# Altium schematic sheet Ada - Base Block - PSU and Connectors Issue 4.0.SchDoc: Title
size A3; DrawnBy: Name; DocumentNumber: 4; Revision: A; SheetNumber: 4; SheetTotal: 4
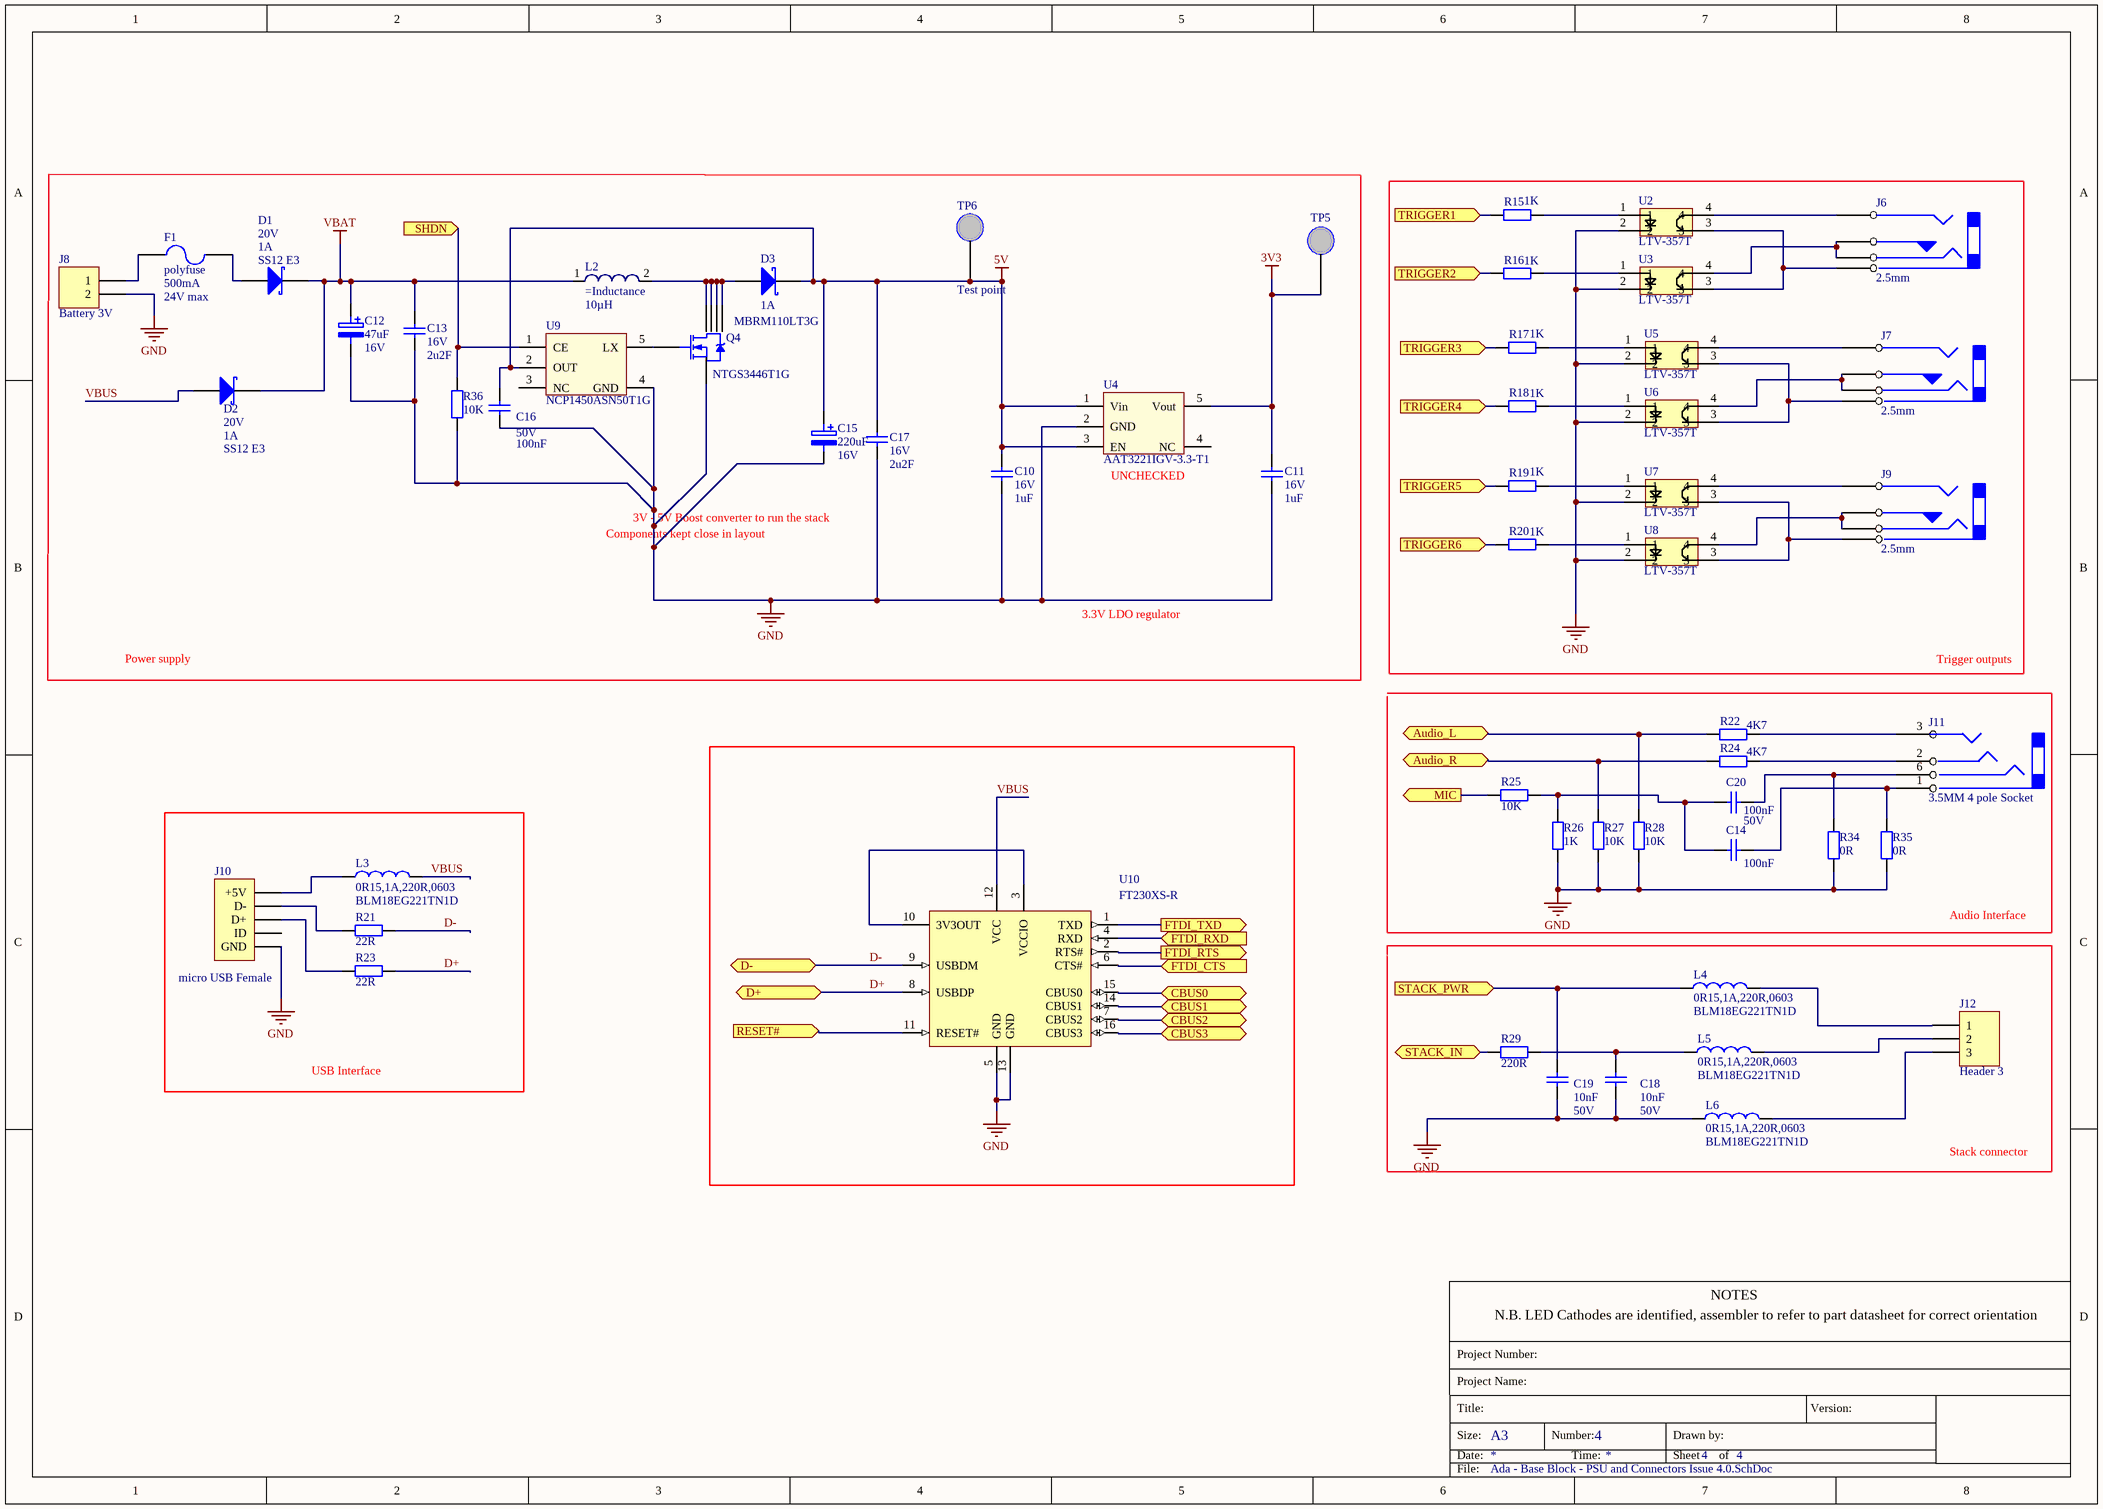
[diagram p0: Ada - Base Block - PSU and Connectors Issue 4.0.SchDoc]

## Parts
C10  value 1uF  Voltage: 16V  [C0603]  (hidden comment: 1uF, 16V, 0603)
C11  value 1uF  Voltage: 16V  [C0603]  (hidden comment: 1uF, 16V, 0603)
C12  value 47uF  Voltage: 16V  [CAP6.8/6.8]  (hidden comment: 10uF,16V,SMD)
C13  Voltage: 16V  [C0603]  (hidden comment: 2u2F)
C14  value 100nF  [C0603]  (hidden comment: 100nF, 16V, 0603)
C15  value 220uF  Voltage: 16V  [CAP6.8/6.8]  (hidden comment: 220uF, 16V, SMD)
C16  value 100nF  Voltage: 50V  [C0603]  (hidden comment: 100nF, 16V, 0603)
C17  Voltage: 16V  [C0603]  (hidden comment: 2u2F)
C18  value 10nF  Voltage: 50V  [C0603]  (hidden comment: Capacitor 0603)
C19  value 10nF  Voltage: 50V  [C0603]  (hidden comment: Capacitor 0603)
C20  value 100nF  Voltage: 50V  [C0603]  (hidden comment: 100nF, 16V, 0603)
D1  value SS12 E3  Voltage: 20V  Current: 1A  [DO214-AA]  (hidden comment: BYM13-40)
D2  value SS12 E3  Voltage: 20V  Current: 1A  [DO214-AA]  (hidden comment: BYM13-40)
D3  Current: 1A  [POWERMITE]  (hidden comment: MBRM110LT3G)
F1  value polyfuse  Current: 500mA  Voltage: 24V max  [1210 FUSE]  (hidden comment: 500mA polyfuse)
J6  value 2.5mm  [2.5mm socket TRI001]  (hidden comment: 2.5mm PHONEJACK STEREO TRI001)
J7  value 2.5mm  [2.5mm socket TRI001]  (hidden comment: 2.5mm PHONEJACK STEREO TRI001)
J8  Battery 3V  [Molex 0022057025]
J9  value 2.5mm  [2.5mm socket TRI001]  (hidden comment: 2.5mm PHONEJACK STEREO TRI001)
J10  micro USB Female  [micro usb receptacle]
J11  value 3.5MM 4 pole Socket  [Cliff 3.5mm 4 pole socket]  (hidden comment: 3.5mm PHONEJACK STEREO TRI001)
J12  Header 3  [sip3]
L2  value 10µH  [WE-PD2_5848]
L3  0R15,1A,220R,0603  value BLM18EG221TN1D  [L0603]
L4  0R15,1A,220R,0603  value BLM18EG221TN1D  [L0603]
L5  0R15,1A,220R,0603  value BLM18EG221TN1D  [L0603]
L6  0R15,1A,220R,0603  value BLM18EG221TN1D  [L0603]
Q4  value NTGS3446T1G  [TSOP6]
R15  value 1K  [R0603]  (hidden comment: Resistor 0603)
R16  value 1K  [R0603]  (hidden comment: Resistor 0603)
R17  value 1K  [R0603]  (hidden comment: Resistor 0603)
R18  value 1K  [R0603]  (hidden comment: Resistor 0603)
R19  value 1K  [R0603]  (hidden comment: Resistor 0603)
R20  value 1K  [R0603]  (hidden comment: Resistor 0603)
R21  value 22R  [R0603]  (hidden comment: Resistor 0603)
R22  value 4K7  [R0603]  (hidden comment: Resistor 0603)
R23  value 22R  [R0603]  (hidden comment: Resistor 0603)
R24  value 4K7  [R0603]  (hidden comment: Resistor 0603)
R25  value 10K  [R0603]  (hidden comment: Resistor 0603)
R26  value 1K  [R0603]  (hidden comment: Resistor 0603)
R27  value 10K  [R0603]  (hidden comment: Resistor 0603)
R28  value 10K  [R0603]  (hidden comment: Resistor 0603)
R29  value 220R  [R0603]  (hidden comment: Resistor 0603)
R34  0R  [R0603]
R35  0R  [R0603]
R36  value 10K  [R0603]  (hidden comment: Resistor 0603)
TP5  Test point  [TP]  (value not drawn)  (no BOM)
TP6  Test point  [TP]  (no BOM)
U2  value LTV-357T  [SMD-4]  (hidden comment: LTV-817)
U3  value LTV-357T  [SMD-4]  (hidden comment: LTV-817)
U4  AAT3221IGV-3.3-T1  [TSOT 5 pin]
U5  value LTV-357T  [SMD-4]  (hidden comment: LTV-817)
U6  value LTV-357T  [SMD-4]  (hidden comment: LTV-817)
U7  value LTV-357T  [SMD-4]  (hidden comment: LTV-817)
U8  value LTV-357T  [SMD-4]  (hidden comment: LTV-817)
U9  value NCP1450ASN50T1G  [SOT23-5AN]  (hidden comment: NCP1450)
U10  FT230XS-R  [SSOP-16_N]

## Blocks framed on the sheet
Trigger outputs: J6 J7 J9 R15-R20 U2 U3 U5-U8
Audio Interface: C14 C20 J11 R22 R24-R28 R34 R35
USB Interface: J10 L3 R21 R23
Stack connector: C18 C19 J12 L4-L6 R29

## Ports
Audio_L (bidir), Audio_R (bidir), CBUS0 (bidir), CBUS1 (bidir), CBUS2 (bidir), CBUS3 (bidir), D+ (bidir), D- (bidir), FTDI_CTS (in), FTDI_RTS (out), FTDI_RXD (in), FTDI_TXD (out), MIC (out), RESET# (in), SHDN (in), STACK_IN (bidir), STACK_PWR (in), TRIGGER1 (in), TRIGGER2 (in), TRIGGER3 (in), TRIGGER4 (in), TRIGGER5 (in), TRIGGER6 (in)

## Nets
3V3: C11.2 TP5.1 U4.5(Vout)
5V: C10.2 C15.1 C16.2 C17.2 D3.K TP6.1 U4.1(Vin) U4.3(EN) U9.2(OUT)
GND: C10.1 C11.1 C12.2 C13.1 C15.2 C16.1 C17.1 C18.1 C19.1 J8.2 J10.5(GND) L6.2 Q4.4(S) R26.2 R27.2 R28.2 R34.2 R35.2 R36.2 U2.2 U3.2 U4.2(GND) U5.2 U6.2 U7.2 U8.2 U9.4(GND) U10.5(GND) U10.13(GND)
VBAT: C12.1 C13.2 D1.K D2.K L2.1
Audio_L: R22.2 R28.1 ; port Audio_L
Audio_R: R24.2 R27.1 ; port Audio_R
CBUS0: U10.15(CBUS0) ; port CBUS0
CBUS1: U10.14(CBUS1) ; port CBUS1
CBUS2: U10.7(CBUS2) ; port CBUS2
CBUS3: U10.16(CBUS3) ; port CBUS3
D+: R23.1 U10.8(USBDP) ; port D+
D-: R21.1 U10.9(USBDM) ; port D-
FTDI_CTS: U10.6(CTS#) ; port FTDI_CTS
FTDI_RTS: U10.2(RTS#) ; port FTDI_RTS
FTDI_RXD: U10.4(RXD) ; port FTDI_RXD
FTDI_TXD: U10.1(TXD) ; port FTDI_TXD
MIC: R25.1 ; port MIC
RESET#: U10.11(RESET#) ; port RESET#
SHDN: R36.1 U9.1(CE) ; port SHDN
STACK_IN: R29.1 ; port STACK_IN
STACK_PWR: C19.2 L4.2 ; port STACK_PWR
TRIGGER1: R15.2 ; port TRIGGER1
TRIGGER2: R16.2 ; port TRIGGER2
TRIGGER3: R17.2 ; port TRIGGER3
TRIGGER4: R18.2 ; port TRIGGER4
TRIGGER5: R19.2 ; port TRIGGER5
TRIGGER6: R20.2 ; port TRIGGER6
VBUS: D2.A L3.2 U10.12(VCC)
NetC14_1: C14.1 J11.1 R35.1
NetC14_2: C14.2 C20.2 R25.2 R26.1
NetC18_2: C18.2 L5.2 R29.2
NetC20_1: C20.1 J11.6 R34.1
NetD1_A: D1.A F1.2
NetD3_A: D3.A L2.2 Q4.1(D) Q4.2(D) Q4.5(D) Q4.6(D)
NetF1_1: F1.1 J8.1
NetJ6_1: J6.1 U2.3 U3.3
NetJ6_2: J6.2 J6.3 U3.4
NetJ6_4: J6.4 U2.4
NetJ7_1: J7.1 U5.3 U6.3
NetJ7_2: J7.2 J7.3 U6.4
NetJ7_4: J7.4 U5.4
NetJ9_1: J9.1 U7.3 U8.3
NetJ9_2: J9.2 J9.3 U8.4
NetJ9_4: J9.4 U7.4
NetJ10_1: J10.1(+5V) L3.1
NetJ10_2: J10.2(D-) R21.2
NetJ10_3: J10.3(D+) R23.2
NetJ11_2: J11.2 R24.1
NetJ11_3: J11.3 R22.1
NetJ12_1: J12.1 L4.1
NetJ12_2: J12.2 L5.1
NetJ12_3: J12.3 L6.1
NetQ4_3: Q4.3(G) U9.5(LX)
NetR15_1: R15.1 U2.1
NetR16_1: R16.1 U3.1
NetR17_1: R17.1 U5.1
NetR18_1: R18.1 U6.1
NetR19_1: R19.1 U7.1
NetR20_1: R20.1 U8.1
NetU10_3: U10.3(VCCIO) U10.10(3V3OUT)

Not connected (* = marked no-connect by the designer): J10 4(ID); U4 4(NC); U9 3(NC)

## Notes on the sheet
- (near U4) UNCHECKED
- Components kept close in layout
- 3V - 5V Boost converter to run the stack
- 3.3V LDO regulator
- Power supply
- N.B. LED Cathodes are identified, assembler to refer to part datasheet for correct orientation
- NOTES
- Project Name:
- Project Number:
- Title:
- Size:
- Date:
- A3
- Number:
- Time:
- Sheet
- Drawn by:
- of
- Version:
- File:

## Library data of the parts
C10 C11 = 1uF, 16V, 0603: Ceramic; Manufacturer: KEMET; Manuf Part #: C0603C105K4PAC; FEC#: 1288256; Part No.: 1288256; Supplier: FEC
C12 = 10uF, 16V, SMD: Electrolitic; Manufacturer: NICHICON; Manuf Part #: UUT1C470MCL1GS; FEC#: 8823200; Part No.: 8823200; Supplier: FEC
C13 C17 = 2u2F, 16V, 0603: Ceramic; Manufacturer: AVX; Manuf Part #: 0603YD225KAT2A; FEC#: 1658871; Part No.: 1658871; Supplier: FEC; Value: 2u2F
C14 = 100nF, 16V, 0603: Ceramic; Manufacturer: TruCap; Manuf Part #: U0603R103; Part No.: 71-1964; Voltage: 50V; Supplier: Rapid
C15 = 220uF, 16V, SMD: Electrolitic; Manufacturer: PANASONIC; Manuf Part #: EEEFPC221XAP; FEC#: 1539479; Part No.: 1539479; Supplier: FEC
C16 C20 = 100nF, 16V, 0603: Ceramic; Manufacturer: TruCap; Manuf Part #: U0603R103; Part No.: 71-1964; Supplier: Rapid
C18 C19 = Capacitor 0603: Ceramic; Manufacturer: MULTICOMP; Manuf Part #: MCCA000238; Part No.: 71-1964; FEC#: 1759104; Supplier: Rapid
D1 D2 = BYM13-40: SCHOTTKY DIODE; Manufacturer: Taiwan Semiconductor; Part No.: 47-0988; Manuf Part #: SS12 E3; Supplier: Rapid
D3 = MBRM110LT3G: SCHOTTKY DIODE 1A, POWERMITE; Manufacturer: ON SEMICONDUCTOR; FEC#: 1459062; Voltage: ?V; Manuf Part #: MBRM110LT3G; Part No.: 1459062; Supplier: FEC; Value: MBRM110LT3G
F1 = 500mA polyfuse: Polyfuse; Manufacturer: LITTELFUSE; Manuf Part #: 1210L050YR; FEC#: 1822208; Part No.: 1822208; Supplier: FEC
J6 J7 J9 = 2.5mm PHONEJACK STEREO TRI001: 2.5mm PHONEJACK STEREO; Manufacturer: PRO SIGNAL; Manuf Part #: PSG01539; FEC#: 1280745; Part No.: 1280745; Supplier: FEC
J8 = Header 2: Header, 2-Pin; Manufacturer: MOLEX; FEC#: 9979670; Manuf Part #: 22-05-7025; Value: 22-05-7025; Part No.: 9979670; Supplier: FEC
J10 = micro USB Female: Header, 5-Pin; Manufacturer: FCI; Manuf Part #: 10118192-0001LF; Part No.: 649-10118192-0001LF; Supplier: MOUSER; Value: micro USB Female
J11 = 3.5mm PHONEJACK 4 pole: 3.5mm PHONEJACK STEREO; Manufacturer: CLIFF ELECTRONIC; Manuf Part #: FC68125; FEC#: 2309468; Part No.: 2309468; Supplier: FEC
J12 = Header 3: Header, 3-Pin; Value: Stack Con
L2 = WE-PD2 5848, M, 74477410: SMD Power Inductor WE-PD2, L=10.0 µH; Manufacturer: Würth Elektronik eiSos GmbH; FEC#: 1636014; Manuf Part #: 74477410; Part No.: 1636014; Supplier: FEC
L3-L6 = 0R15,1A,220R,0603: FERRITE BEAD; Manufacturer: MURATA; FEC#: 1515717; RS#: 724-1328; Current: 1A; Manuf Part #: BLM18EG221TN1D; Part No.: 1515717; Supplier: FEC
Q4 = IRLML0060TRPBF: N-channel MOSFET Transistor 5.1A 20V, 6-Pin TSOP; Manufacturer: ON Semiconductor; RS#: 802-4221; Manuf Part #: NTGS3446T1G; Part No.: 802-4221; Supplier: RS
R34 R35 = Resistor 0603: Value: 0R
U2 U3 U5-U8 = LTV-817: OPTOCOUPLER, 5KV, TRANSISTOR O/P; Manufacturer: Lite-on; Part No.: 859-LTV-357T; Manuf Part #: LTV-357T; Supplier: MOUSER
U4 = AAT3221IGV-3.3-T1: 3.3V LDO Regulator; Manufacturer: Skyworks Solutions; Part No.: 873-AAT3221IGV-33T1; FEC#: 1117859; Manuf Part #: AAT3221IGV-3.3-T1; Supplier: MOUSER; Value: AAT3221IGV-3.3-T1
U9 = NCP1402SN50T1G: DC-DC STEP UP CONVERTER, 5.0V, SMD; Manufacturer: ON SEMICONDUCTOR; FEC#: 1460676; Manuf Part #: NCP1450ASN50T1G; Part No.: 1460676; Supplier: FEC
U10 = FT230XS-R: USB to Basic UART Interface Chip, UHCI/OHCI/EHCI Compatible, USB 2.0 Compatible, -40 to +85 degC, 16-Pin SSOP, Pb-Free, Tape and Reel; Manufacturer: FTDI; Part No.: 895-FT230XS-R; Value: FT230X; Manuf Part #: FT230XS-R; Supplier: MOUSER